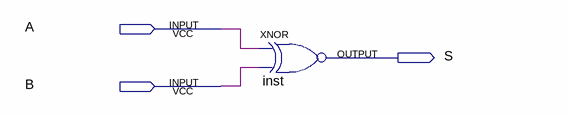
[diagram p0: schematic sheet]
// Quartus schematic Xnor_entry.bdf as structural Verilog: 1 symbols, 3 pins
module Xnor_entry (
  input  A,
  input  B,
  output S
);

  xnor inst (S, A, B);
endmodule
